# Altium schematic sheet top_aux_r.SchDoc
size A4; SheetNumber: 8; SheetTotal: 8
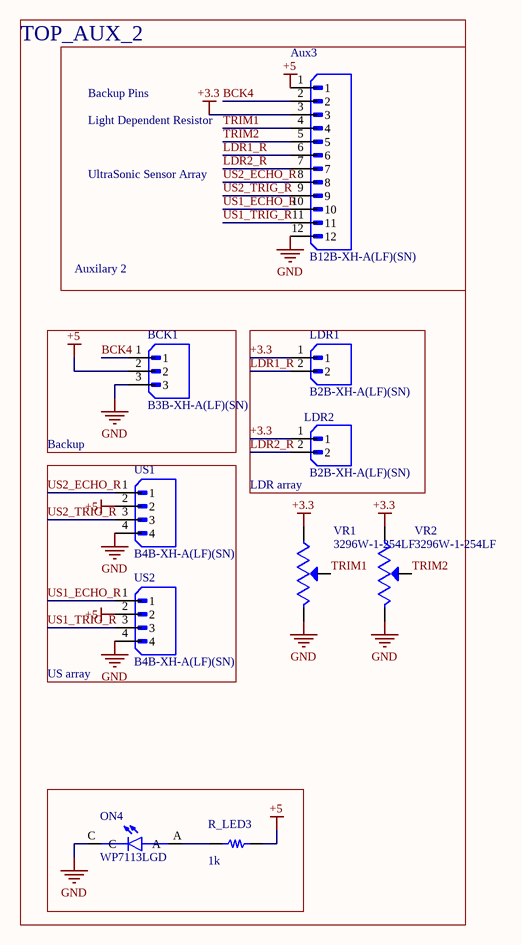
[diagram p0: top_aux_r.SchDoc]

## Parts
Aux3  B12B-XH-A(LF)(SN)  [JST_B12B-XH-A(LF)(SN)]
BCK1  B3B-XH-A(LF)(SN)  [JST_B3B-XH-A(LF)(SN)]
LDR1  B2B-XH-A(LF)(SN)  [JST_B2B-XH-A(LF)(SN)]
LDR2  B2B-XH-A(LF)(SN)  [JST_B2B-XH-A(LF)(SN)]
ON4  WP7113LGD  [LED_WP7113LGD]
R_LED3  1k  [generic_res_footprint]
US1  B4B-XH-A(LF)(SN)  [JST_B4B-XH-A(LF)(SN)]
US2  B4B-XH-A(LF)(SN)  [JST_B4B-XH-A(LF)(SN)]
VR1  3296W-1-254LF  [TRIM_3296W-1-254LF]
VR2  3296W-1-254LF  [TRIM_3296W-1-254LF]

## Blocks framed on the sheet
TOP_AUX_2: Aux3 ON4 R_LED3 VR1 VR2
Backup: BCK1
LDR array: LDR1 LDR2
US array: US1 US2

## Nets
+3.3: Aux3.3 LDR1.1 LDR2.1 VR1.1(CCW) VR2.1(CCW)
+5: Aux3.1 BCK1.2 R_LED3.2 US1.2 US2.2
GND: Aux3.12 BCK1.3 ON4.C US1.4 US2.4 VR1.3(CW) VR2.3(CW)
BCK4: Aux3.2 BCK1.1
LDR1_R: Aux3.6 LDR1.2
LDR2_R: Aux3.7 LDR2.2
TRIM1: Aux3.4 VR1.2(WIPER)
TRIM2: Aux3.5 VR2.2(WIPER)
US1_ECHO_R: Aux3.10 US2.1
US1_TRIG_R: Aux3.11 US2.3
US2_ECHO_R: Aux3.8 US1.1
US2_TRIG_R: Aux3.9 US1.3
NetON4_A: ON4.A R_LED3.1

## Notes on the sheet
- Backup Pins
- Light Dependent Resistor
- UltraSonic Sensor Array
- Auxilary 2

## Library data of the parts
Aux3 = CMP-398-000513-1: Connector Header Through Hole 12 position 0.098 (2.50mm); MF: JST Sales; Package: None; SnapEDA_Link: https://www.snapeda.com/parts/B12B-XH-A(LF)(SN)/JST+Sales+America+Inc./view-part/?ref=snap; Source: B12B-XH-A(LF)(SN).SchLib; Check_prices: https://www.snapeda.com/parts/B12B-XH-A(LF)(SN)/JST+Sales+America+Inc./view-part/?ref=eda; Value: *; Design Item ID: B12B-XH-A(LF)(SN); MP: B12B-XH-A(LF)(SN); Pin Count: 12; Component Type: Standard
BCK1 = CMP-330-000000-1: Connector Header Through Hole 3 position 0.098 (2.50mm); MF: JST Sales; Value: *; Check_prices: https://www.snapeda.com/parts/B3B-XH-A(LF)(SN)/JST+Sales+America+Inc./view-part/?ref=eda; Component Type: Standard; Source: B3B-XH-A(LF)(SN).SchLib; MP: B3B-XH-A(LF)(SN); Design Item ID: B3B-XH-A(LF)(SN); SnapEDA_Link: https://www.snapeda.com/parts/B3B-XH-A(LF)(SN)/JST+Sales+America+Inc./view-part/?ref=snap; Pin Count: 3; Package: None
LDR1 LDR2 = CMP-332-000000-1: Connector Header Through Hole 2 position 0.098 (2.50mm); MF: JST Sales America Inc.; Component Type: Standard; Value: *; Check_prices: https://www.snapeda.com/parts/B2B-XH-A(LF)(SN)/JST+Sales+America+Inc./view-part/?ref=eda; Package: None; MP: B2B-XH-A(LF)(SN); SnapEDA_Link: https://www.snapeda.com/parts/B2B-XH-A(LF)(SN)/JST+Sales+America+Inc./view-part/?ref=snap; Pin Count: 2; Source: B2B-XH-A(LF)(SN).SchLib; Design Item ID: B2B-XH-A(LF)(SN)
ON4 = CMP-352-000000-1: Green 568nm LED Indication - Discrete 1.9V Radial; MF: Kingbright; Value: *; Component Type: Standard; Design Item ID: WP7113LGD; Package: Radial Kingbright; Price: None; Source: WP7113LGD.SchLib; SnapEDA_Link: https://www.snapeda.com/parts/WP7113LGD/Kingbright/view-part/?ref=snap; Check_prices: https://www.snapeda.com/parts/WP7113LGD/Kingbright/view-part/?ref=eda; Pin Count: 2; Availability: In Stock; Purchase-URL: https://pricing.snapeda.com/search/part/WP7113LGD/?ref=eda; MP: WP7113LGD
R_LED3 = CMP-340-000000-2: Generic through hole resistor
US1 US2 = CMP-328-000000-1: Connector Header Through Hole 4 position 0.098 (2.50mm); MF: JST Sales; Pin Count: 4; Value: *; Check_prices: https://www.snapeda.com/parts/B4B-XH-A(LF)(SN)/JST+Sales+America+Inc./view-part/?ref=eda; SnapEDA_Link: https://www.snapeda.com/parts/B4B-XH-A(LF)(SN)/JST+Sales+America+Inc./view-part/?ref=snap; MP: B4B-XH-A(LF)(SN); Source: B4B-XH-A(LF)(SN).SchLib; Package: None; Component Type: Standard; Design Item ID: B4B-XH-A(LF)(SN)
VR1 VR2 = CMP-402-000001-1: 250 kOhms 0.5W, 1/2W PC Pins Through Hole Trimmer Potentiometer Cermet 25.0 Turn Top Adjustment; MF: Bourns; Source: 3296W-1-254LF.SchLib; Purchase-URL: https://pricing.snapeda.com/search/part/3296W-1-254LF/?ref=eda; Value: *; Price: None; MP: 3296W-1-254LF; Availability: In Stock; Pin Count: 3; Check_prices: https://www.snapeda.com/parts/3296W-1-254LF/Bourns+-+J.W.+Miller/view-part/?ref=eda; Design Item ID: 3296W-1-254LF; Component Type: Standard; SnapEDA_Link: https://www.snapeda.com/parts/3296W-1-254LF/Bourns+-+J.W.+Miller/view-part/?ref=snap; Package: SOT-23-5 Bourns